# EAGLE design +-9V_PSU (EAGLE 7.2.0)
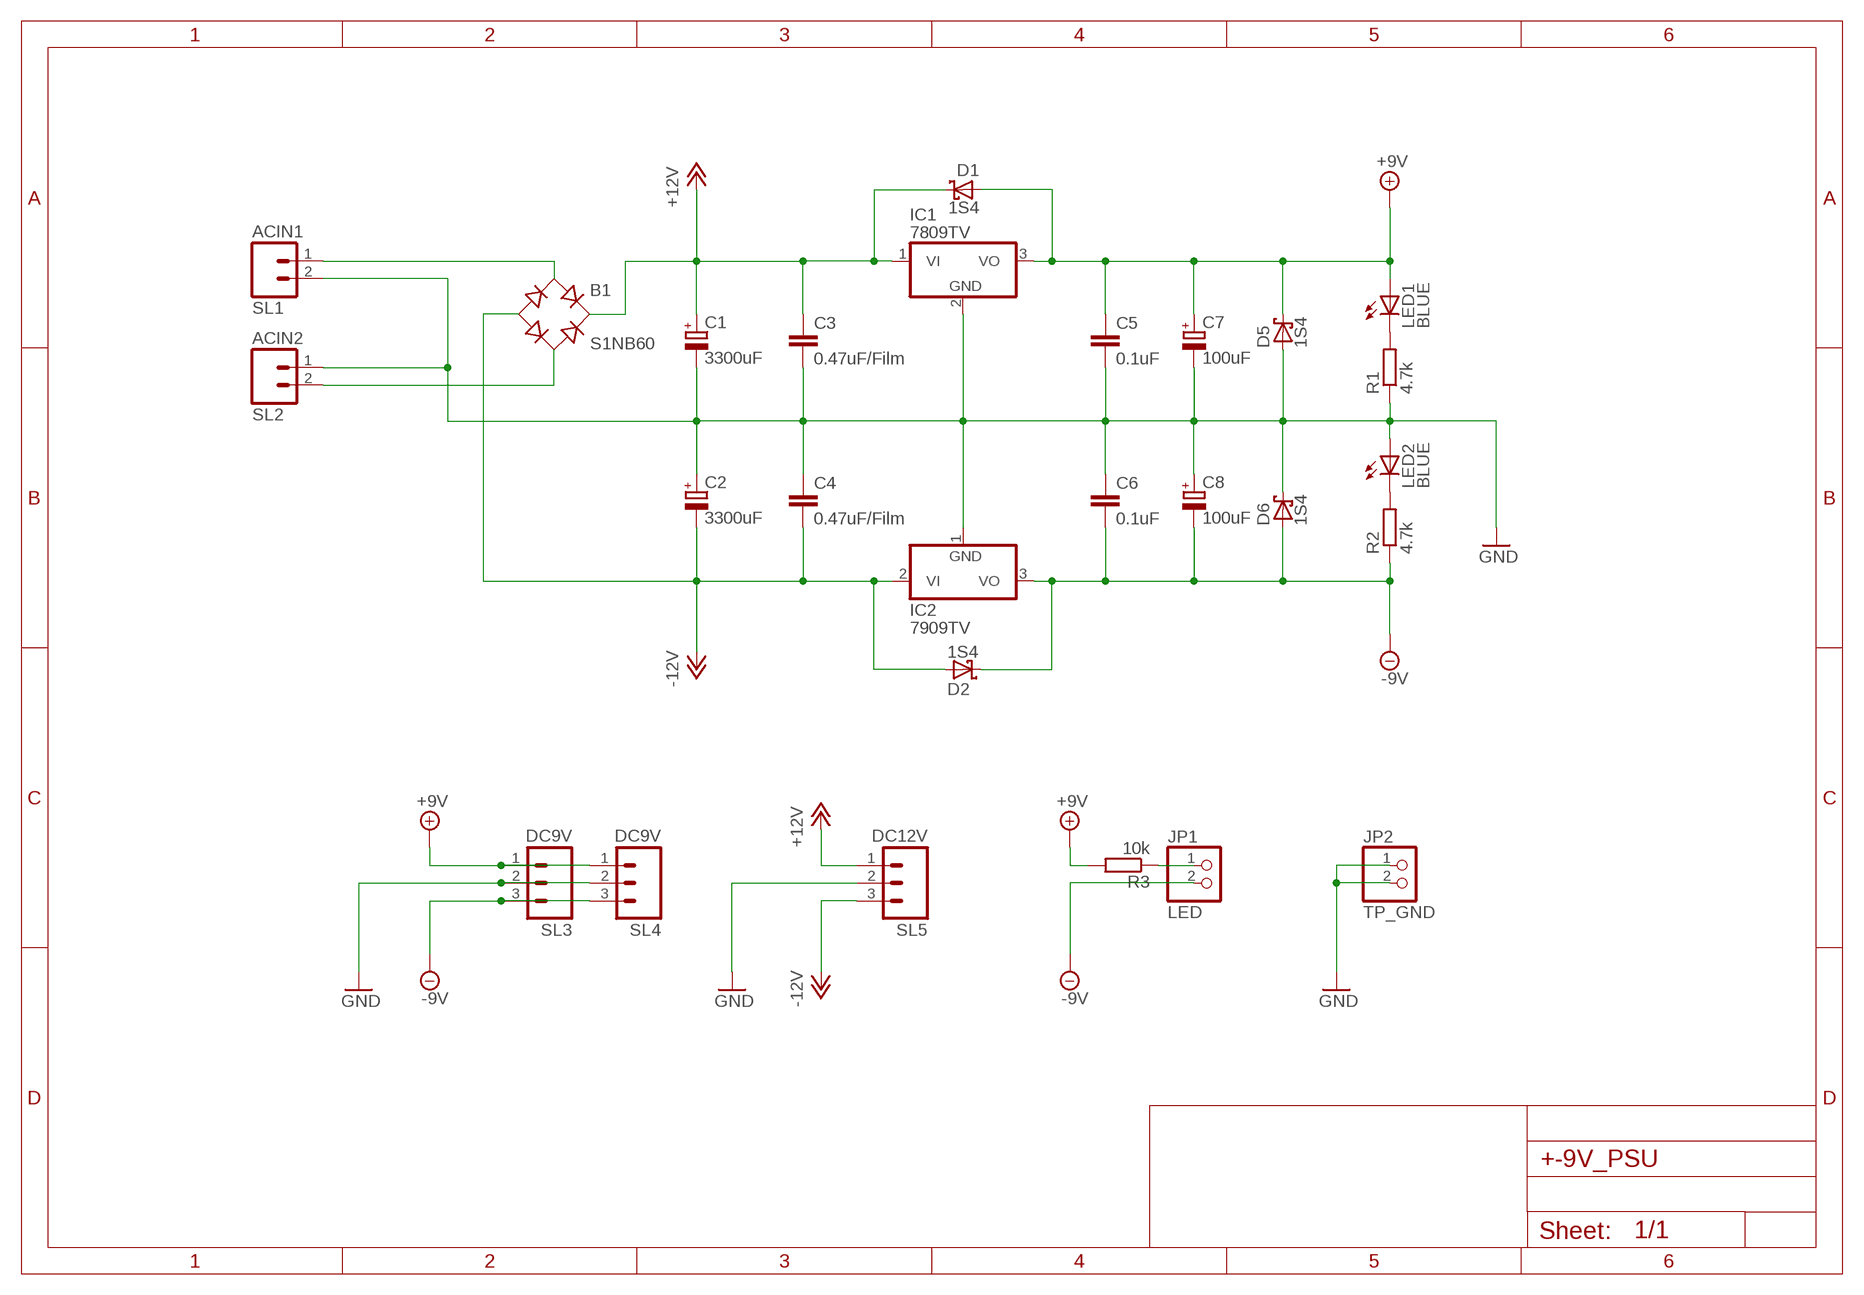
[diagram p0: schematic, sheet 1]

## Parts
B1  S1NB60  B-DIL  [B-DIL]
C1  3300uF  CPOL-EUE10-25  [EB25D]
C2  3300uF  CPOL-EUE10-25  [EB25D]
C3  0.47uF/Film  C-EU050-045X075  [C050-045X075]
C4  0.47uF/Film  C-EU050-045X075  [C050-045X075]
C5  0.1uF  C-EU025-024X044  [C025-024X044]
C6  0.1uF  C-EU025-024X044  [C025-024X044]
C7  100uF  CPOL-EUSANYO_C6  [SANYO-OSCON_C6]
C8  100uF  CPOL-EUSANYO_C6  [SANYO-OSCON_C6]
D1  1S4  SCHOTTKY-DIODEDO35-7  [DO35-7]
D2  1S4  SCHOTTKY-DIODEDO35-7  [DO35-7]
D5  1S4  SCHOTTKY-DIODEDO35-7  [DO35-7]
D6  1S4  SCHOTTKY-DIODEDO35-7  [DO35-7]
IC1  7809TV  7805TV  [TO220V]
IC2  7909TV  7905TV  [TO220V]
JP1  LED  PINHD-1X2  [1X02]
JP2  TP_GND  PINHD-1X2  [1X02]
LED1  BLUE  LED3MM  [LED3MM]
LED2  BLUE  LED3MM  [LED3MM]
R1  4.7k  R-EU_0207/7  [0207/7]
R2  4.7k  R-EU_0207/7  [0207/7]
R3  10k  R-EU_0207/7  [0207/7]
SL1  ACIN1  M02  [02P]
SL2  ACIN2  M02  [02P]
SL3  DC9V  M03  [03P]
SL4  DC9V  M03  [03P]
SL5  DC12V  M03  [03P]

## Nets
+9V: C5.1 C7.+ D1.A D5.C IC1.3(VO) LED1.A R3.2 SL3.1 SL4.1
+12V: B1.+ C1.+ C3.1 D1.C IC1.1(VI) SL5.1
-9V: C6.2 C8.- D2.C D6.A IC2.3(VO) JP1.2 R2.1 SL3.3 SL4.3
-12V: B1.- C2.- C4.2 D2.A IC2.2(VI) SL5.3
GND: C1.- C2.+ C3.2 C4.1 C5.2 C6.1 C7.- C8.+ D5.A D6.C IC1.2(GND) IC2.1(GND) JP2.1 JP2.2 LED2.A R1.1 SL1.2 SL2.1 SL3.2 SL4.2 SL5.2
N$1: LED2.K(C) R2.2
N$2: JP1.1 R3.1
N$3: LED1.K(C) R1.2
N$4: B1.AC1 SL1.1
N$6: B1.AC2 SL2.2

## Library data of the parts
B1 = rectifier:B-DIL: RECTIFIER
C1 C2 C7 C8 = rcl:CPOL-EU: POLARIZED CAPACITOR, European symbol
C3-C6 = rcl:C-EU: CAPACITOR, European symbol
D1 D2 D5 D6 = diode:SCHOTTKY-DIODE: Schottky Diode
IC1 = linear:78*: Positive VOLTAGE REGULATOR Source: http://cache.national.com/ds/LM/LM78L05.pdf http://www.fairchildsemi.com/ds/LM/LM7805.pdf
IC2 = mylib2:7905TV
JP1 JP2 = pinhead:PINHD-1X2: PIN HEADER
LED1 LED2 = led:LED: LED OSRAM: - CHIPLED LG R971, LG N971, LY N971, LG Q971, LY Q971, LO R971, LY R971 LH N974, LH R974 LS Q976, LO Q976, LY Q976 LO Q996 - Hyper CHIPLED LW Q18S LB Q993, LB Q99A, LB R99A - SideLED LS A670, LO A670, LY A670, LG A670, LP A670 LB A673, LV A673, LT A673, LW A673 LH A674 LY A675 LS A676, LA A676, LO A676, LY A676, LW A676 LS A679, LY A679, LG A679 - Hyper Micro SIDELED® LS Y876, LA Y876, LO Y876, LY Y876 LT Y87S - SmartLED LW L88C, LW L88S LB L89C, LB L89S, LG L890 LS L89K, LO L89K, LY L89K LS L896, LA L896, LO L896, LY L896 - TOPLED LS T670, LO T670, LY T670, LG T670, LP T670 LSG T670, LSP T670, LSY T670, LOP T670, LYG T670 LG T671, LOG T671, LSG T671 LB T673, LV T673, LT T673, LW T673 LH T674 LS T676, LA T676, LO T676, LY T676, LB T676, LH T676, LSB T676, LW T676 LB T67C, LV T67C, LT T67C, LS T67K, LO T67K, LY T67K, LW E67C LS E67B, LA E67B, LO E67B, LY E67B, LB E67C, LV E67C, LT E67C LW T67C LS T679, LY T679, LG T679 LS T770, LO T770, LY T770, LG T770, LP T770 LB T773, LV T773, LT T773, LW T773 LH T774 LS E675, LA E675, LY E675, LS T675 LS T776, LA T776, LO T776, LY T776, LB T776 LHGB T686 LT T68C, LB T68C - Hyper Mini TOPLED® LB M676 - Mini TOPLED Santana® LG M470 LS M47K, LO M47K, LY M47K Source: http://www.osram.convergy.de LUXEON: - LUMILED® LXK2-PW12-R00, LXK2-PW12-S00, LXK2-PW14-U00, LXK2-PW14-V00 LXK2-PM12-R00, LXK2-PM12-S00, LXK2-PM14-U00 LXK2-PE12-Q00, LXK2-PE12-R00, LXK2-PE12-S00, LXK2-PE14-T00, LXK2-PE14-U00 LXK2-PB12-K00, LXK2-PB12-L00, LXK2-PB12-M00, LXK2-PB14-N00, LXK2-PB14-P00, LXK2-PB14-Q00 LXK2-PR12-L00, LXK2-PR12-M00, LXK2-PR14-Q00, LXK2-PR14-R00 LXK2-PD12-Q00, LXK2-PD12-R00, LXK2-PD12-S00 LXK2-PH12-R00, LXK2-PH12-S00 LXK2-PL12-P00, LXK2-PL12-Q00, LXK2-PL12-R00 Source: www.luxeon.com KINGBRIGHT: KA-3528ASYC Source: www.kingbright.com
R1-R3 = rcl:R-EU_: RESISTOR, European symbol
SL1 SL2 = con-amp-quick:M02: AMP QUICK CONNECTOR; OC_FARNELL: unknown; OC_NEWARK: unknown
SL3-SL5 = con-amp-quick:M03: AMP QUICK CONNECTOR; OC_FARNELL: unknown; OC_NEWARK: unknown

## Board
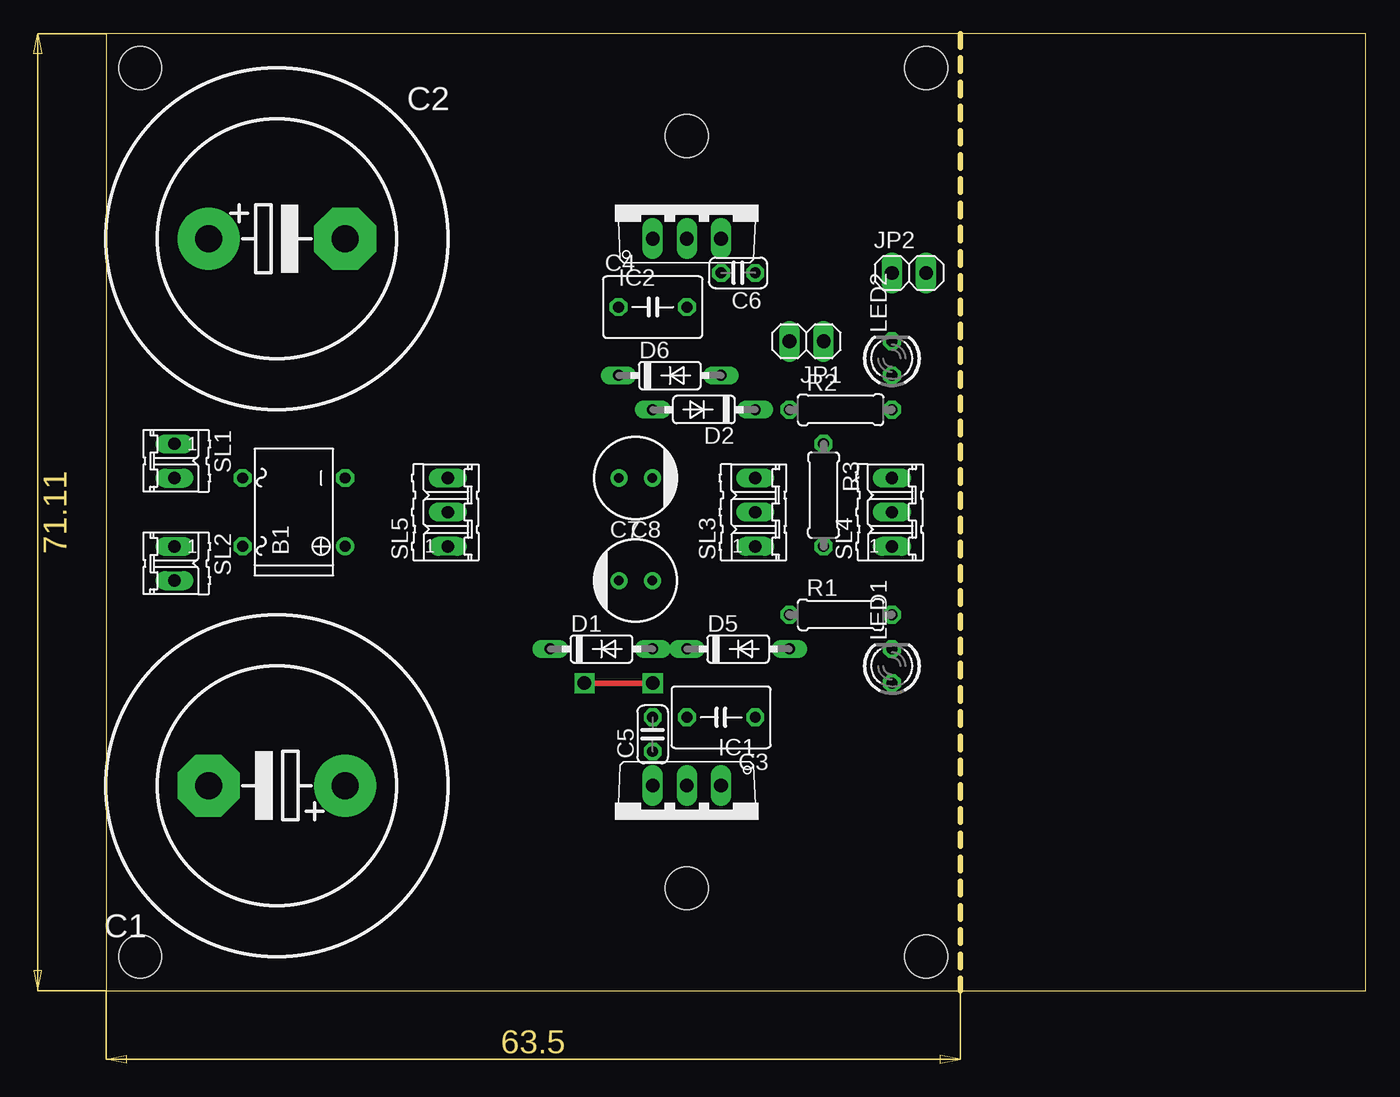
[diagram p1: board, top side]
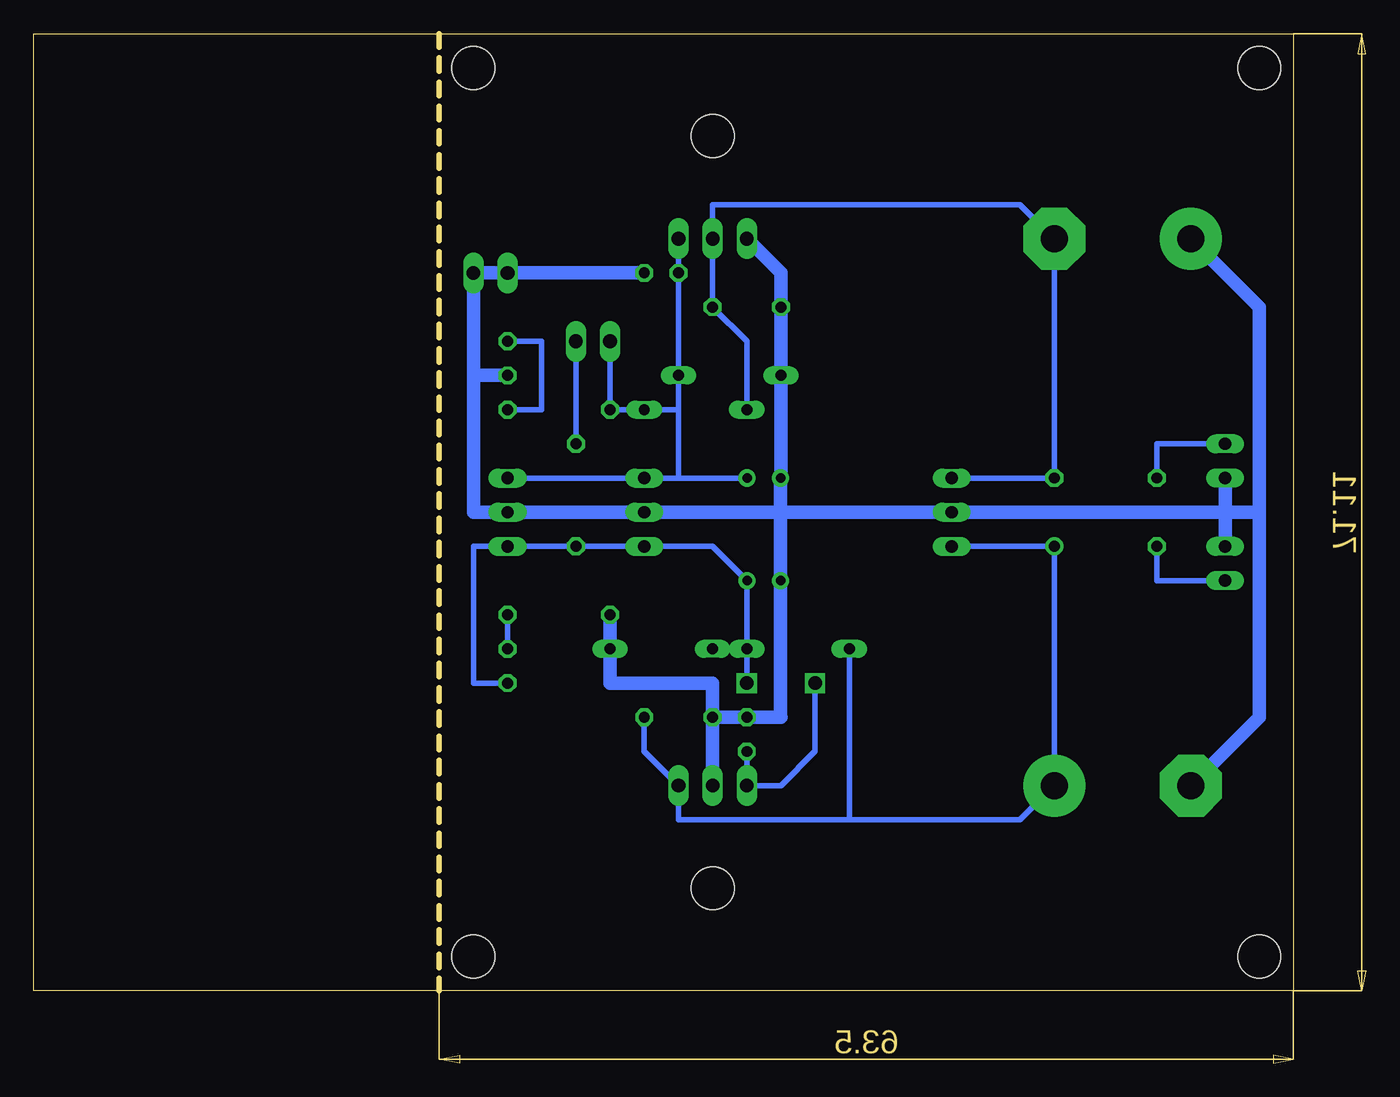
[diagram p2: board, bottom side, seen from below]

Size 93.65 x 71.11 mm. Coordinates in mm from the lower left corner, seen from the top.
Outline: 63.5,0 0,0 0,71.11 93.65,71.11 93.65,0 63.5,0
Outline: 63.5,71.12 63.5,0
Copper layers (1*16): Top 0.035mm / dielectric 1.5mm / Bottom 0.035mm
Design rules "default": minimum track width 10mil, minimum drill 24mil, track to track 8mil, track to pad 8mil, pad to pad 8mil, via to via 8mil, smd to smd 8mil, copper to edge 40mil, drill to drill 8mil, minimum pad ring 10mil, minimum via ring 8mil, stop-mask expansion 4mil, vias tented up to drill 0mil, thermal gap 10mil
Holes 3.2 mm at 2.54,68.58 2.54,2.54 60.96,68.58 60.96,2.54 43.18,7.62 43.18,63.5
tKeepout: area 30.5,2.5 to 55.9,20.3; area 30.5,50.8 to 55.9,68.6

### Footprints (pad centres in the part's own frame; a part is rotated, then mirrored left to right if it is on the bottom)
B-DIL = drill 0.813: + -2.54,-3.81 | drill 0.813 octagon: - 2.54,-3.81; AC1 2.54,3.81; AC2 -2.54,3.81
EB25D = drill 2.007 pad 4.597: + -5.08,0 | drill 2.007 pad 4.597 octagon: - 5.08,0
C050-045X075 = drill 0.813 octagon: 1 -2.54,0; 2 2.54,0
C025-024X044 = drill 0.813 octagon: 1 -1.27,0; 2 1.27,0
SANYO-OSCON_C6 = drill 0.7 pad 1.27: + 1.25,0; - -1.25,0
DO35-7 = drill 0.813 long: A 3.81,0; C -3.81,0
TO220V = drill 1.016 long: 1 -2.54,-2.54; 2 0,-2.54; 3 2.54,-2.54
TO220V' = drill 1.016 long: 1 -2.54,0; 2 0,0; 3 2.54,0
1X02 = drill 1.016 long: 1 -1.27,0; 2 1.27,0
LED3MM = drill 0.813 octagon: A -1.27,0; K 1.27,0
0207/7 = drill 0.813 octagon: 1 -3.81,0; 2 3.81,0
02P = drill 0.914 long: 1 -1.27,0; 2 1.27,0
03P = drill 0.914 long: 1 -2.54,0; 2 0,0; 3 2.54,0

### Placement (x,y rotation side)
B1  13.97,35.56 90 top
C1  12.7,15.24 180 top
C2  12.7,55.88 0 top
C3  45.72,20.32 180 top
C4  40.64,50.8 0 top
C5  40.64,19.05 90 top
C6  46.99,53.34 180 top
C7  39.37,30.48 0 top
C8  39.37,38.1 180 top
D1  36.83,25.4 0 top
D2  44.45,43.18 180 top
D5  46.99,25.4 0 top
D6  41.91,45.72 0 top
IC1  43.18,12.7 180 top
IC2  7909TV  [TO220V']  43.18,55.88 0 top
JP1  52.07,48.26 180 top
JP2  59.69,53.34 0 top
LED1  58.42,24.13 90 top
LED2  58.42,46.99 90 top
R1  54.61,27.94 0 top
R2  54.61,43.18 0 top
R3  53.34,36.83 270 top
SL1  5.08,39.37 270 top
SL2  5.08,31.75 270 top
SL3  48.26,35.56 90 top
SL4  58.42,35.56 90 top
SL5  25.4,35.56 90 top

### Tracks (layer width: path | path; a pad name or v marks a point on that pad's centre or on a via)
+9V  (via drill 1)
  Top 0.406: v40.64,22.86 v35.56,22.86
  Bottom 0.406: C5.1 IC1.3 38.1,15.24 35.56,17.78 v35.56,22.86 | D1.A 40.62,25.42 C7.+ 40.64,30.48 43.18,33.02 SL3.1 R3.2 SL4.1 60.96,33.02 60.96,22.86 LED1.A | D5.C D1.A | D1.A v40.64,22.86
+12V
  Bottom 0.406: C3.1 48.26,17.78 IC1.1 45.72,12.7 33.02,12.7 | SL5.1 B1.+ C1.+ 20.32,12.7 33.02,12.7 | D1.C 33.02,12.7
-9V
  Bottom 0.406: IC2.3 C6.2 D6.A 45.72,43.18 | SL4.3 SL3.3 45.72,38.1 | JP1.2 R2.1 D2.C 45.72,43.18 | 45.72,38.1 C8.- | 45.72,43.18 45.72,38.1
-12V
  Bottom 0.406: SL5.3 B1.- C2.- 20.32,58.42 43.18,58.42 IC2.2 C4.2 40.64,48.26 D2.A
GND
  Bottom 1.016: C2.+ 2.54,50.8 2.54,35.56 | 2.54,35.56 2.54,20.32 C1.- | 5.08,35.56 SL5.2 38.1,35.56 | 5.08,35.56 2.54,35.56 | IC1.2 C3.2 | IC2.1 38.1,53.34 C4.1 D6.C 38.1,38.12 C8.+ 38.12,35.58 38.1,35.56 | 38.1,35.56 SL3.2 SL4.2 60.96,35.56 60.96,45.72 | 38.1,35.56 38.12,35.54 C7.- 38.12,20.32 | R1.1 D5.A 50.8,22.86 43.18,22.86 C3.2 | LED2.A 60.96,45.72 | 60.96,45.72 JP2.2 JP2.1 C6.1 | 38.12,20.32 C5.2 C3.2 | 38.1,20.32 38.12,20.32 | SL1.2 5.08,35.56 | SL2.1 5.08,35.56
N$1
  Bottom 0.406: LED2.K 55.88,48.26 55.88,43.18 R2.2
N$2
  Bottom 0.406: JP1.1 R3.1
N$3
  Bottom 0.406: R1.2 LED1.K
N$4
  Bottom 0.406: SL1.1 10.16,40.64 B1.AC1
N$6
  Bottom 0.406: SL2.2 10.16,30.48 B1.AC2

### Text on the board
Document: (-) | (+)